# Altium project PT-PWR-EPS-002_v1.PrjPcb (part 1 of 5)
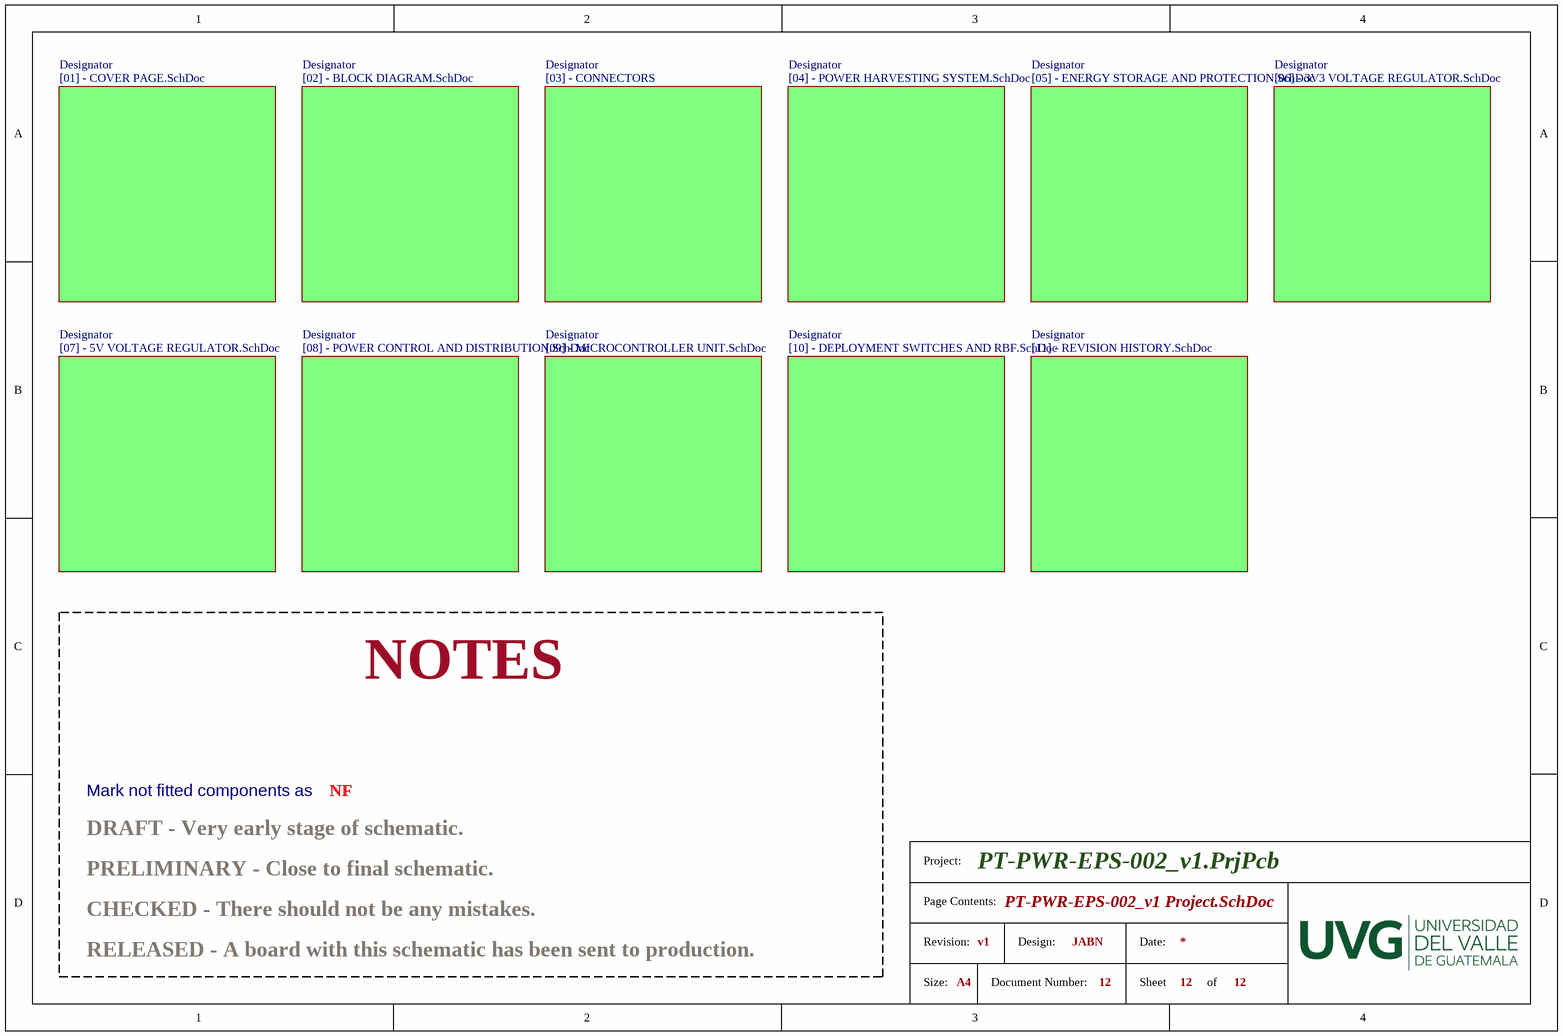
[diagram p0: PT-PWR-EPS-002_v1 Project.SchDoc]
Checked: JABN; DocumentRevision: v1
12 sheets, 217 parts. Net scope: flat (ports and power ports of the same name join across sheets).
Board file: PT-PWR-EPS-002_v1.PcbDoc
Sheets:
  PT-PWR-EPS-002_v1 Project.SchDoc
    Designator = [01] - COVER PAGE.SchDoc
    Designator = [02] - BLOCK DIAGRAM.SchDoc
    Designator = [06] - 3V3 VOLTAGE REGULATOR.SchDoc
    Designator = [04] - POWER HARVESTING SYSTEM.SchDoc
    Designator = [03] - CONNECTORS.SchDoc
    Designator = [05] - ENERGY STORAGE AND PROTECTION.SchDoc
    Designator = [10] - DEPLOYMENT SWITCHES AND RBF.SchDoc
    Designator = [08] - POWER CONTROL AND DISTRIBUTION.SchDoc
    Designator = [07] - 5V VOLTAGE REGULATOR.SchDoc
    Designator = [11] - REVISION HISTORY.SchDoc
    Designator = [09] - MICROCONTROLLER UNIT.SchDoc

## Sheet PT-PWR-EPS-002_v1 Project.SchDoc
size A4; DocumentNumber: 12; SheetNumber: 12; SheetTotal: 12

### Sub-sheets
Designator = [01] - COVER PAGE.SchDoc: no entries
Designator = [02] - BLOCK DIAGRAM.SchDoc: no entries
Designator = [06] - 3V3 VOLTAGE REGULATOR.SchDoc: no entries
Designator = [04] - POWER HARVESTING SYSTEM.SchDoc: no entries
Designator = [03] - CONNECTORS: no entries
Designator = [05] - ENERGY STORAGE AND PROTECTION.SchDoc: no entries
Designator = [10] - DEPLOYMENT SWITCHES AND RBF.SchDoc: no entries
Designator = [08] - POWER CONTROL AND DISTRIBUTION.SchDoc: no entries
Designator = [07] - 5V VOLTAGE REGULATOR.SchDoc: no entries
Designator = [11] - REVISION HISTORY.SchDoc: no entries
Designator = [09] - MICROCONTROLLER UNIT.SchDoc: no entries

### Notes on the sheet
- NOTES
- DRAFT - Very early stage of schematic.
- Mark not fitted components as
- NF
- PRELIMINARY - Close to final schematic.
- CHECKED - There should not be any mistakes.
- RELEASED - A board with this schematic has been sent to production.
- Project:
- Page Contents:
- Size:
- Revision:
- A4
- Document Number:
- Design:
- Date:
- Sheet
- of

## Sheet [01] - COVER PAGE.SchDoc
size A4; DocumentNumber: 1; SheetNumber: 1; SheetTotal: 12
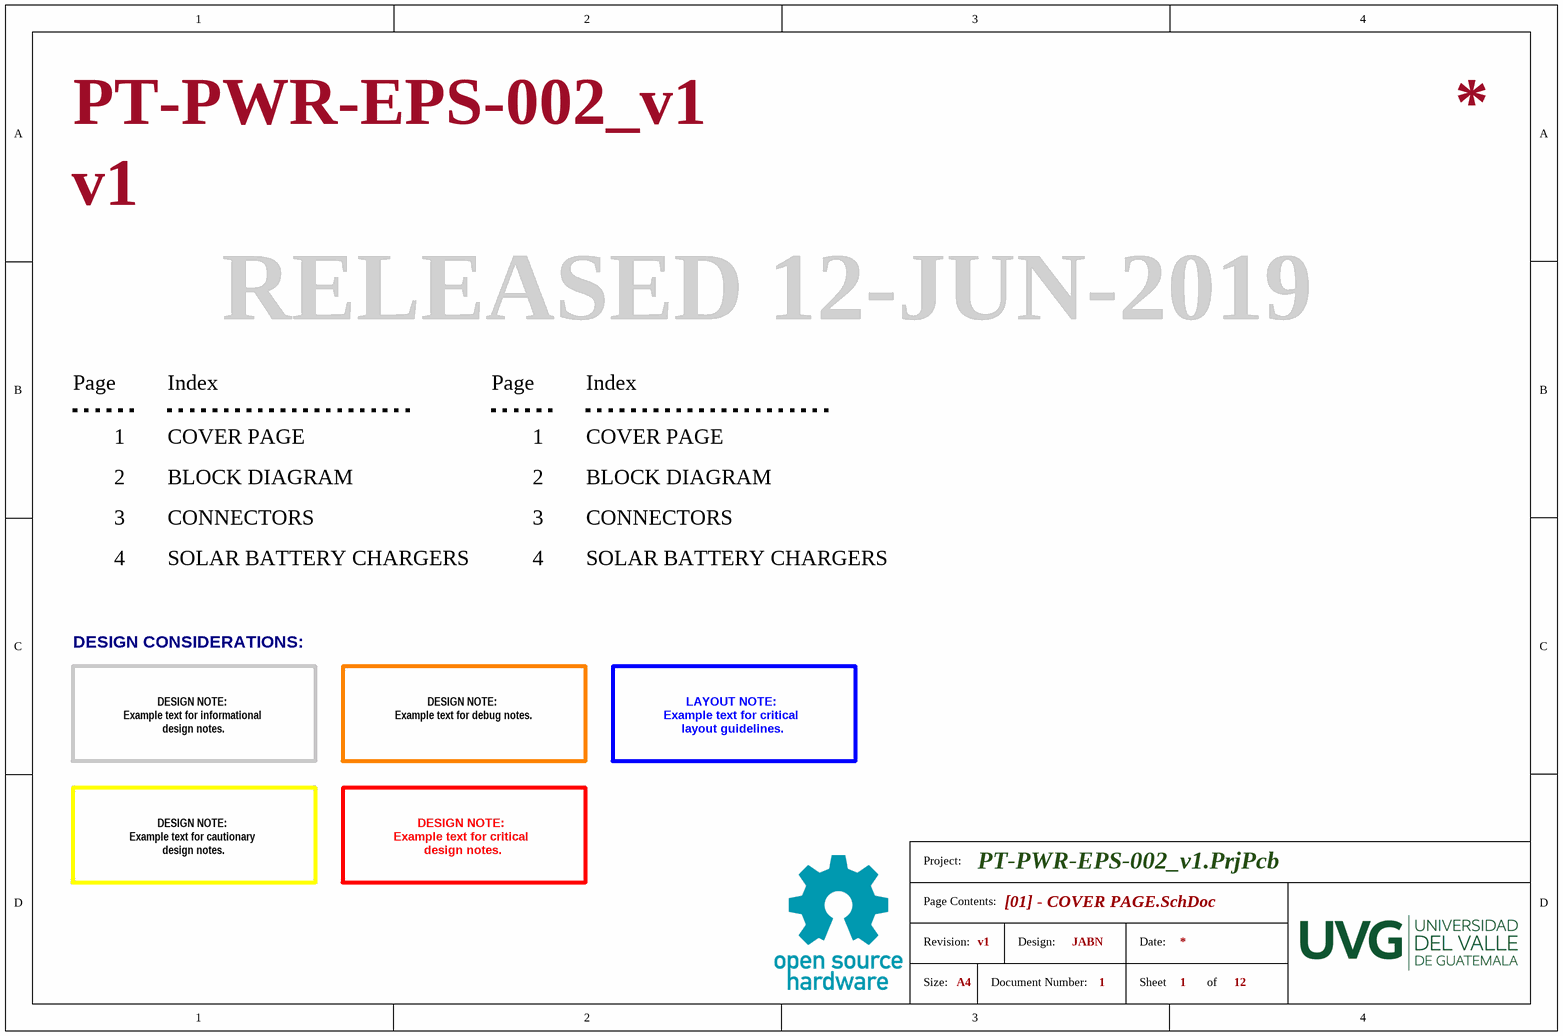
[diagram p1: [01] - COVER PAGE.SchDoc]

### Notes on the sheet
- PT-PWR-EPS-002_v1
- RELEASED 12-JUN-2019
- Page
- 1
- Index
- COVER PAGE
- 2
- BLOCK DIAGRAM
- 3
- 4
- CONNECTORS
- SOLAR BATTERY CHARGERS
- DESIGN CONSIDERATIONS:
- DESIGN NOTE:
  Example text for debug notes.
- DESIGN NOTE:
  Example text for informational
  design notes.
- LAYOUT NOTE:
  Example text for critical
  layout guidelines.
- DESIGN NOTE:
  Example text for cautionary
  design notes.
- DESIGN NOTE:
  Example text for critical
  design notes.
- Project:
- Page Contents:
- Size:
- Revision:
- A4
- Document Number:
- Design:
- Date:
- Sheet
- of

## Sheet [02] - BLOCK DIAGRAM.SchDoc
size A4; DocumentNumber: 2; SheetNumber: 2; SheetTotal: 12
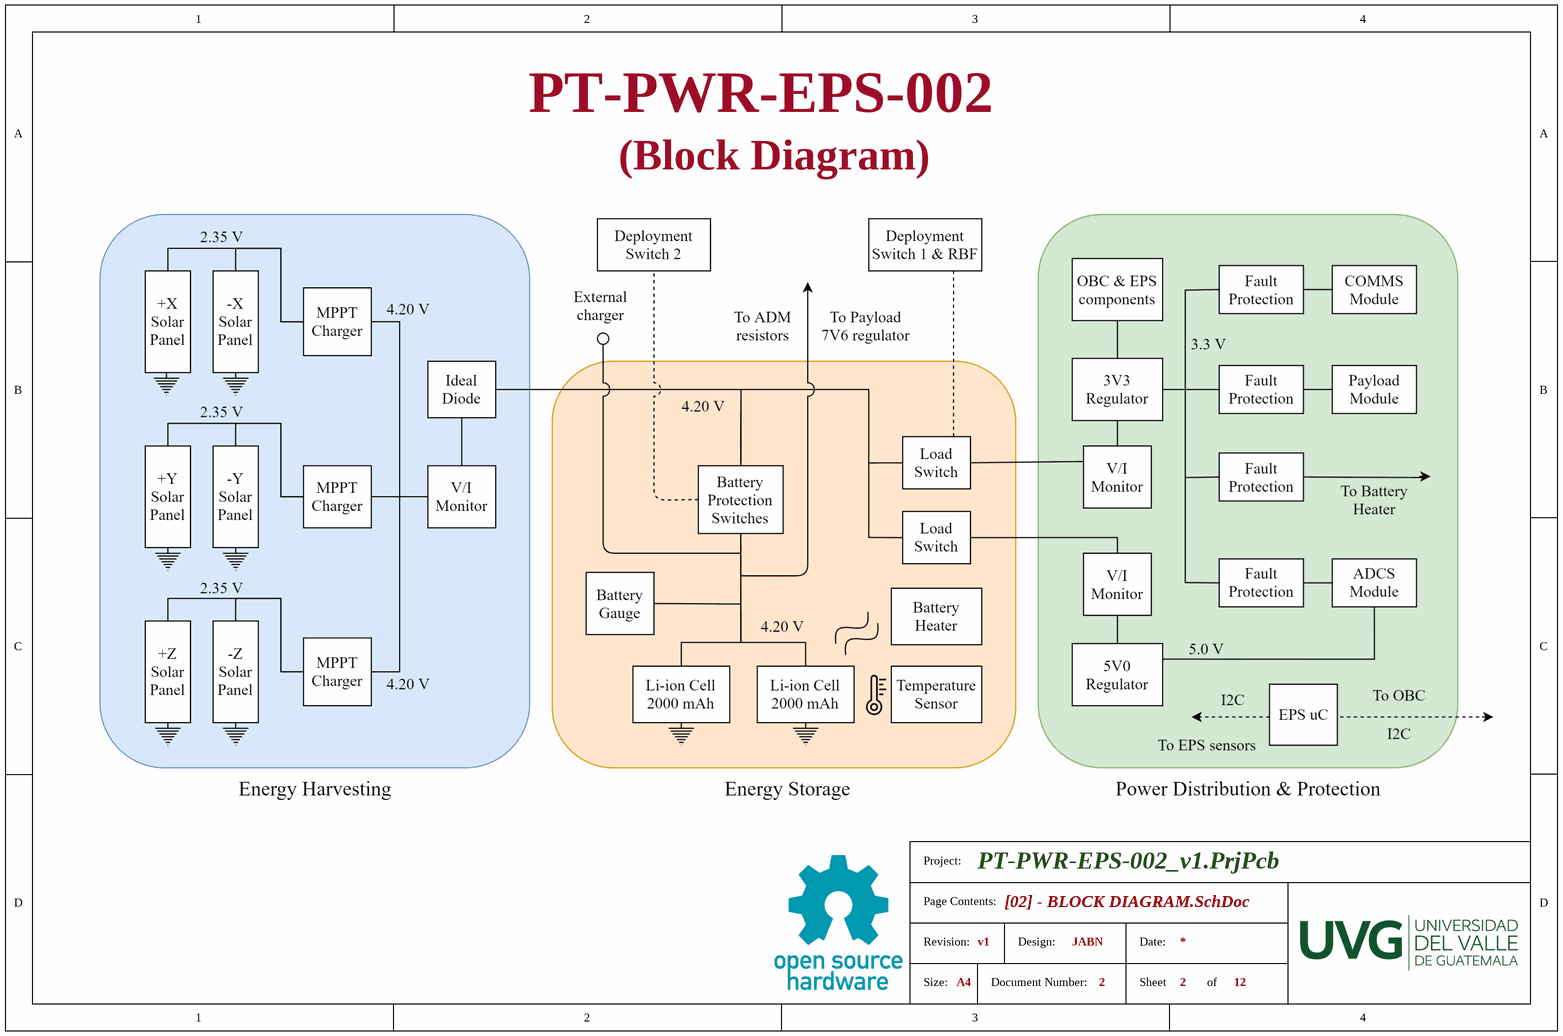
[diagram p2: [02] - BLOCK DIAGRAM.SchDoc]

### Notes on the sheet
- PT-PWR-EPS-002
- (Block Diagram)
- Project:
- Page Contents:
- Size:
- Revision:
- A4
- Document Number:
- Design:
- Date:
- Sheet
- of

## Sheet [06] - 3V3 VOLTAGE REGULATOR.SchDoc
size A2; DocumentNumber: 5; SheetNumber: 5; SheetTotal: 5; PageSetup: Record=PageOptions|CenterHorizontal=True|CenterVertical=True|PrintScale=0.73|XCorrection=1.00|YCorrection=1.00|PrintKind=0|BorderSize=5000000|LeftOffset=0|BottomOffset=0|Orientation=2|PaperLength=1000|PaperWidth=1000|Scale=100|PaperSource=7|PrintQuality=-3|MediaType=1|DitherType=10|PrintScaleMode=1|PaperKind=A3|PaperIndex=8
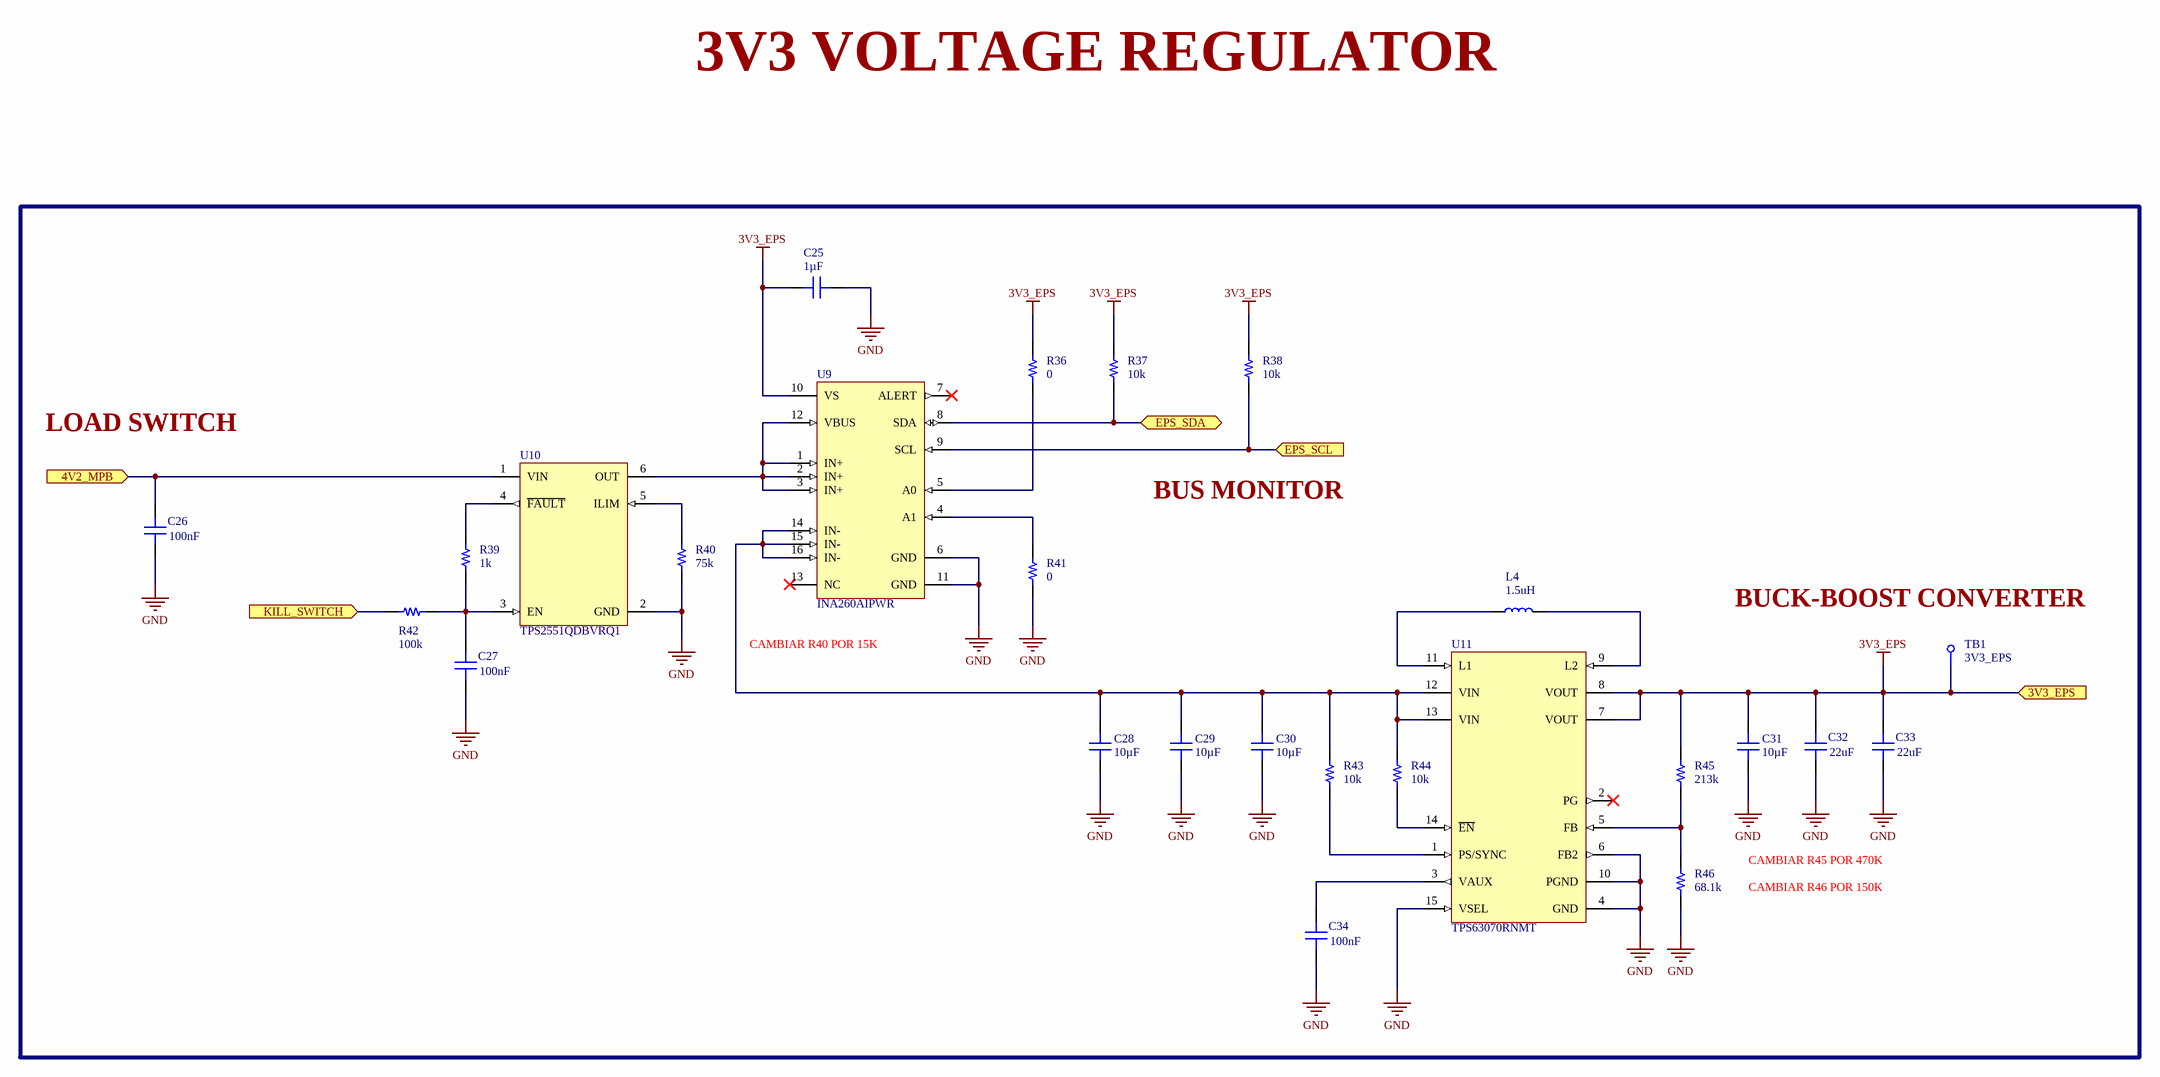
[diagram p3: [06] - 3V3 VOLTAGE REGULATOR.SchDoc]

### Parts
C25  Capacitance: 1µF  [CAP 0603/1608]  (hidden comment: CL10A105KP8NNNC)
C26  Capacitance: 100nF  [CAP 0603/1608]  (hidden comment: C0603C104K8RACTU)
C27  Capacitance: 100nF  [CAP 0603/1608]  (hidden comment: C0603C104K8RACTU)
C28  Capacitance: 10µF  [CAP 0805/2012]  (hidden comment: LMK212BJ106KG-T)
C29  Capacitance: 10µF  [CAP 0805/2012]  (hidden comment: LMK212BJ106KG-T)
C30  Capacitance: 10µF  [CAP 0603/1608]  (hidden comment: CL10A106MQ8NNNC)
C31  Capacitance: 10µF  [CAP 0603/1608]  (hidden comment: CL10A106MQ8NNNC)
C32  Capacitance: 22uF  [CAP 0805/2012]  (hidden comment: CL21A226MQQNNNE)
C33  Capacitance: 22uF  [CAP 0805/2012]  (hidden comment: CL21A226MQQNNNE)
C34  Capacitance: 100nF  [CAP 0603/1608]  (hidden comment: C0603C104K8RACTU)
L4  Inductance: 1.5uH  [XFL4020]  (hidden comment: XFL4020-152MEB)
R36  Resistance: 0  [RES 0603/1608]  (hidden comment: RMCF0603ZT0R00)
R37  Resistance: 10k  [RES 0603/1608]  (hidden comment: RNCP0603FTD10K0)
R38  Resistance: 10k  [RES 0603/1608]  (hidden comment: RNCP0603FTD10K0)
R39  Resistance: 1k  [RES 0603/1608]  (hidden comment: ESR03EZPJ102)
R40  Resistance: 75k  [RES 0603/1608]  (hidden comment: ERJ3EKF7502V)
R41  Resistance: 0  [RES 0603/1608]  (hidden comment: RMCF0603ZT0R00)
R42  Resistance: 100k  [RES 0603/1608]  (hidden comment: CR0603-JW-104ELF)
R43  Resistance: 10k  [RES 0805/2012]  (hidden comment: RC0805FR-0710KL)
R44  Resistance: 10k  [RES 0805/2012]  (hidden comment: RC0805FR-0710KL)
R45  Resistance: 213k  [RES 0603/1608]  (hidden comment: RNCF0603BTE213K)
R46  Resistance: 68.1k  [RES 0603/1608]  (hidden comment: RMCF0603FT68K1)
TB1  3V3_EPS  [Testpoint]
U9  INA260AIPWR  [TSOP65P640X120-16N]
U10  TPS2551QDBVRQ1  [SOT23-6]
U11  TPS63070RNMT  [15-VQFN-HR]

### Ports
3V3_EPS (in), 4V2_MPB (in), EPS_SCL (in), EPS_SDA (bidir), KILL_SWITCH (in)

### Nets
3V3_EPS: C25.1 C31.2 C32.2 C33.2 R36.2 R37.2 R38.2 R45.2 TB1.1 U9.10(VS) U11.7(VOUT) U11.8(VOUT) ; port 3V3_EPS
4V2_MPB: C26.2 U10.1(VIN) ; port 4V2_MPB
GND: C25.2 C26.1 C27.1 C28.1 C29.1 C30.1 C31.1 C32.1 C33.1 C34.1 R40.1 R41.1 R46.1 U9.6(GND) U9.11(GND) U10.2(GND) U11.4(GND) U11.6(FB2) U11.10(PGND) U11.15(VSEL)
NetC27_2: C27.2 R39.1 R42.2 U10.3(EN)
NetC28_2: C28.2 C29.2 C30.2 R43.2 R44.2 U9.14(IN-) U9.15(IN-) U9.16(IN-) U11.12(VIN) U11.13(VIN)
NetC34_2: C34.2 U11.3(VAUX)
NetL4_1: L4.1 U11.11(L1)
NetL4_2: L4.2 U11.9(L2)
NetP11_2: R37.1 U9.8(SDA) ; port EPS_SDA
NetP11_3: R38.1 U9.9(SCL) ; port EPS_SCL
NetR36_1: R36.1 U9.5(A0)
NetR39_2: R39.2 U10.4(~{FAULT})
NetR40_2: R40.2 U10.5(ILIM)
NetR41_2: R41.2 U9.4(A1)
NetR42_1: R42.1 ; port KILL_SWITCH
NetR43_1: R43.1 U11.1(PS/SYNC)
NetR44_1: R44.1 U11.14(~{EN})
NetR45_1: R45.1 R46.2 U11.5(FB)
NetU9_1: U9.1(IN+) U9.2(IN+) U9.3(IN+) U9.12(VBUS) U10.6(OUT)

Not connected (* = marked no-connect by the designer): U9 7(ALERT)* 13(NC)*; U11 2(PG)*

### Notes on the sheet
- 3V3 VOLTAGE REGULATOR
- LOAD SWITCH
- BUS MONITOR
- (near TB1) BUCK-BOOST CONVERTER
- CAMBIAR R40 POR 15K
- CAMBIAR R45 POR 470K
- CAMBIAR R46 POR 150K
- Project:
- Page Contents:
- Size:
- Revision:
- A2
- Document Number:
- Design:
- Date:
- Sheet
- of

### Library data of the parts
C25 = CL10A105KP8NNNC: CAP CER 1UF 10V X5R 0603; Manufacturer: Samsung; Tolerance: 10%; Supplier 1: Digi-Key; Manufacturer Part Number: CL10A105KP8NNNC; Stock 1: 4411775; Pricing 1: 1 = 0.10000, 10 = 0.03800, 100 = 0.01680, 500 = 0.01200, 1000 = 0.00943 (USD); RoHS: Yes; Mount: Surface Mount; Case/Package: 0603; Case Code (Metric): 1608; Case Code (Imperial): 0603; Contact Plating: Tin; Min Operating Temperature: -55°C; Max Operating Temperature: 85°C; Packaging: Tape and Reel; Package Quantity: 1; Voltage Rating: 10V; Dielectric: X5R; Voltage: 10V; Length: 1.6mm; Height: 0.8mm; Width: 0.031inch; Thickness: 0.035inch; Depth: 0.8mm; Radiation Hardening: No; ComponentLink1URL: https://datasheet.ciiva.com/15195/getdatasheetpartid-358616-15195708.pdf?src-supplier=Verical; ComponentLink1Description: https://datasheet.ciiva.com/15195/getdatasheetpartid-358616-15195708.pdf?src-supplier=Verical; ComponentLink2URL: https://datasheet.ciiva.com/16358/cl05b104kq5nnnc-16358431.pdf?src-supplier=Future+Electronics; ComponentLink2Description: https://datasheet.ciiva.com/16358/cl05b104kq5nnnc-16358431.pdf?src-supplier=Future+Electronics; Supplier Part Number 1: 1276-1182-1-ND
C26 C27 C34 = C0603C104K8RACTU: CAP CER 0.1UF 10V X7R 0603; Manufacturer: KEMET; Dielectric Material: Ceramic; Tolerance: 10%; Dissipation Factor: 5%; Supplier 1: Digi-Key; Manufacturer Part Number: C0603C104K8RACTU; Stock 1: 778651; Pricing 1: 1=0.15, 10=0.107, 100=0.0504, 500=0.03536, 1000=0.02927 (USD); Mount: Surface Mount,PCB; Case/Package: 0603; Number of Pins: 2; Case Code (Imperial): 0603; Case Code (Metric): 1608; Contact Plating: Tin,Matte; Min Operating Temperature: -55°C; Max Operating Temperature: 125°C; Voltage Rating: 10V; Packaging: Tape and Reel; Package Quantity: 1; Voltage Rating (DC): 10V; Dielectric: X7R; Termination: SMD/SMT; Voltage: 10V; Length: 1.6mm; Height: 0.8mm; Width: 0.8mm; Lead Pitch: 0.7mm; Thickness: 0.034inch; Depth: 0.8mm; Radiation Hardening: No; REACH SVHC: No SVHC; ComponentLink1URL: http://www.farnell.com/datasheets/2315110.pdf?src-supplier=Farnell; ComponentLink1Description: http://www.farnell.com/datasheets/2315110.pdf?src-supplier=Farnell; ComponentLink2URL: http://www.kemet.com/kemet/web/homepage/kechome.nsf/vapubfiles/KEM_C1002_X7R_SMD.pdf/$file/KEM_C1002_X7R_SMD.pdf?src-supplier=Element14; ComponentLink2Description: http://www.kemet.com/kemet/web/homepage/kechome.nsf/vapubfiles/KEM_C1002_X7R_SMD.pdf/$file/KEM_C1002_X7R_SMD.pdf?src-supplier=Element14; ComponentLink3URL: https://www.verical.com/server-webapp/html/getDatasheet?partID=91529&src-supplier=Verical; ComponentLink3Description: https://www.verical.com/server-webapp/html/getDatasheet?partID=91529&src-supplier=Verical; ComponentLink4URL: http://www.mouser.com/ds/2/212/KEM_C1002_X7R_SMD-1102033.pdf?src-supplier=Mouser; ComponentLink4Description: http://www.mouser.com/ds/2/212/KEM_C1002_X7R_SMD-1102033.pdf?src-supplier=Mouser; ComponentLink5URL: http://www.alliedelec.com/m/d/9bfe7773041ffe9d406e68bc7b377fdd.pdf?src-supplier=Allied+Electronics; ComponentLink5Description: http://www.alliedelec.com/m/d/9bfe7773041ffe9d406e68bc7b377fdd.pdf?src-supplier=Allied+Electronics; ComponentLink6URL: http://www.farnell.com/datasheets/1851736.pdf?src-supplier=Element14; ComponentLink6Description: http://www.farnell.com/datasheets/1851736.pdf?src-supplier=Element14; Supplier Part Number 1: 399-1095-1-ND
C28 C29 = LMK212BJ106KG-T: CAP CER 10UF 10V X5R 0805; Manufacturer: Taiyo Yuden; PCN Part Number: X5R, X7R Dielectrics 23/Jan/2008; Catalog Drawings: xMK Series_0805_1.25; Featured Product: Multilayer Chip Capacitors; Tolerance: ±10%; Online Catalog: M Series; Kits: 587-1797-KIT-ND  - KIT CAP CER HI CAP 0603 & 0805 S; Other Names: 587-1300-1; Supplier 1: Digi-Key; Manufacturer Part Number: LMK212BJ106KG-T; Stock 1: 858762; Pricing 1: 1=0.14, 10=0.1, 100=0.0468, 500=0.0328, 1000=0.0272 (USD); Standard Package: 1; Category: Capacitors; Family: Ceramic Capacitors; Series: M; Packaging: Cut Tape (CT); Voltage - Rated: 10V; Temperature Coefficient: X5R; Mounting Type: Surface Mount, MLCC; Operating Temperature: -55°C ~ 85°C; Applications: General Purpose; Ratings: -; Package / Case: 0805 (2012 Metric); Size / Dimension: 0.079" L x 0.049" W (2.00mm x 1.25mm); Height - Seated (Max): -; Thickness (Max): 0.053" (1.35mm); Lead Spacing: -; Features: -; Lead Style: -; ComponentLink1URL: https://datasheet.ciiva.com/26872/getdatasheetpartid-638410-26872692.pdf; ComponentLink1Description: https://datasheet.ciiva.com/26872/getdatasheetpartid-638410-26872692.pdf; ComponentLink2URL: https://datasheet.ciiva.com/7975/1497285-7975797.pdf; ComponentLink2Description: https://datasheet.ciiva.com/7975/1497285-7975797.pdf; ComponentLink3URL: https://datasheet.ciiva.com/7975/1497285-7975799.pdf; ComponentLink3Description: https://datasheet.ciiva.com/7975/1497285-7975799.pdf; ComponentLink4URL: https://datasheet.ciiva.com/135/mlcc-all-e-135133.pdf; ComponentLink4Description: https://datasheet.ciiva.com/135/mlcc-all-e-135133.pdf; ComponentLink5URL: https://datasheet.ciiva.com/135/mlcc-all-e-135134.pdf; ComponentLink5Description: https://datasheet.ciiva.com/135/mlcc-all-e-135134.pdf; ComponentLink6URL: https://datasheet.ciiva.com/30259/719lmk212abj106kg-t-30259022.pdf; ComponentLink6Description: https://datasheet.ciiva.com/30259/719lmk212abj106kg-t-30259022.pdf; ComponentLink7URL: https://datasheet.ciiva.com/135/mlcc-all-e-135135.pdf; ComponentLink7Description: https://datasheet.ciiva.com/135/mlcc-all-e-135135.pdf; Supplier Part Number 1: 587-1300-1-ND
C30 C31 = CL10A106MQ8NNNC: CAP CER 10UF 6.3V X5R 0603; Manufacturer: Samsung; Tolerance: 20%; Supplier 1: Digi-Key; Manufacturer Part Number: CL10A106MQ8NNNC; Stock 1: 3866590; Pricing 1: 1 = 0.15000, 10 = 0.11000, 100 = 0.05150, 500 = 0.03614, 1000 = 0.02992 (USD); RoHS: Yes; Mount: Surface Mount; Case/Package: 0603; Case Code (Metric): 1608; Case Code (Imperial): 0603; Contact Plating: Tin; Min Operating Temperature: -55°C; Max Operating Temperature: 85°C; Package Quantity: 1; Packaging: Tape and Reel; Voltage Rating: 6.3V; Dielectric: X5R; Voltage: 6.3V; Length: 1.6mm; Height: 0.8mm; Width: 0.031inch; Thickness: 0.035inch; Depth: 0.8mm; Radiation Hardening: No; ComponentLink1URL: https://datasheet.ciiva.com/25798/cl10a106mq8nnnc-25798320.pdf?src-supplier=Digi-Key; ComponentLink1Description: https://datasheet.ciiva.com/25798/cl10a106mq8nnnc-25798320.pdf?src-supplier=Digi-Key; ComponentLink2URL: https://datasheet.ciiva.com/26838/getdatasheetpartid-357557-26838347.pdf?src-supplier=Verical; ComponentLink2Description: https://datasheet.ciiva.com/26838/getdatasheetpartid-357557-26838347.pdf?src-supplier=Verical; ComponentLink3URL: https://datasheet.ciiva.com/16437/cl05b104kq5nnnc-16437327.pdf?src-supplier=Future+Electronics; ComponentLink3Description: https://datasheet.ciiva.com/16437/cl05b104kq5nnnc-16437327.pdf?src-supplier=Future+Electronics; Supplier Part Number 1: 1276-1119-1-ND
C32 C33 = CL21A226MQQNNNE: CAP CER 22UF 6.3V X5R 0805; Manufacturer: Samsung; Tolerance: 20%; Supplier 1: Digi-Key; Manufacturer Part Number: CL21A226MQQNNNE; Stock 1: 20000; Pricing 1: 1=0.22, 10=0.152, 100=0.0768, 500=0.05256, 1000=0.04649 (USD); Mount: Surface Mount; Case/Package: 0805; Contact Plating: Tin; Case Code (Metric): 2012; Case Code (Imperial): 0805; Min Operating Temperature: -55°C; Max Operating Temperature: 85°C; Package Quantity: 2000; Packaging: Tape and Reel; Voltage Rating: 6.3V; Dielectric: X5R; Voltage Rating (DC): 6.3V; Length: 2mm; Height: 1.25mm; Width: 0.049inch; Thickness: 0.055inch; Depth: 1.25mm; Radiation Hardening: No; Lead Free: Lead Free; ComponentLink1URL: https://datasheet.ciiva.com/25796/cl21a226mqqnnne-25796195.pdf; ComponentLink1Description: https://datasheet.ciiva.com/25796/cl21a226mqqnnne-25796195.pdf; ComponentLink2URL: https://datasheet.ciiva.com/26838/getdatasheetpartid-357607-26838611.pdf; ComponentLink2Description: https://datasheet.ciiva.com/26838/getdatasheetpartid-357607-26838611.pdf; ComponentLink3URL: https://datasheet.ciiva.com/16361/cl21a226mqqnnne-16361189.pdf; ComponentLink3Description: https://datasheet.ciiva.com/16361/cl21a226mqqnnne-16361189.pdf; ComponentLink4URL: https://datasheet.ciiva.com/26787/cl21a226mqqnnne-26787006.pdf; ComponentLink4Description: https://datasheet.ciiva.com/26787/cl21a226mqqnnne-26787006.pdf; Supplier Part Number 1: 1276-1100-6-ND
L4 = XFL4020-152MEB: FIXED IND 1.5UH 9.1A 15.8 MOHM SMD; Manufacturer: Coilcraft; Core Material: Composite; Self Resonant Frequency: 59MHz; Shielding: Shielded; Tolerance: 20%; DC Resistance (DCR): 15.8mR; Test Frequency: 100kHz; Supplier 1: Mouser; Manufacturer Part Number: XFL4020-152MEB; Stock 1: 11555; Pricing 1: 1 = 1.99000, 10 = 1.99000, 50 = 1.99000, 100 = 1.59000, 1000 = 0.88500, 10000 = 0.88500 (USD); RoHS: Yes; Min Operating Temperature: -40°C; Max Operating Temperature: 125°C; Packaging: Tape and Reel; Max DC Current: 9.1A; Termination: SMD/SMT; Package Quantity: 25; Length: 4.3mm; Height: 2.1mm; Width: 4.3mm; Lead Free: Contains Lead; ComponentLink1URL: http://www.mouser.com/ds/2/597/xfl4020-270756.pdf?src-supplier=Mouser; ComponentLink1Description: http://www.mouser.com/ds/2/597/xfl4020-270756.pdf?src-supplier=Mouser; Supplier Part Number 1: 994-XFL4020-152MEB
R36 R41 = RMCF0603ZT0R00: RES SMD 0 OHM JUMPER 1/10W 0603; Manufacturer: Stackpole Electronics; Power Rating: 100mW; Current Rating: 1A; Working Voltage: 75V; Supplier 1: Digi-Key; Manufacturer Part Number: RMCF0603ZT0R00; Stock 1: 3031399; Pricing 1: 1 = 0.10000, 10 = 0.01600, 25 = 0.01160, 50 = 0.00880, 100 = 0.00640, 250 = 0.00492, 500 = 0.00392, 1000 = 0.00289 (USD); RoHS: Yes; Mount: Surface Mount; Case/Package: 0603; Case Code (Metric): 1608; Case Code (Imperial): 0603; Contact Plating: Tin; Min Operating Temperature: -55°C; Max Operating Temperature: 155°C; Packaging: Tape and Reel; Composition: Thick Film; Number of Terminations: 2; Military Standard: Not; Max Power Dissipation: 100mW; Features: Automotive AEC-Q200; Length: 1.55mm; Height: 0.022inch; Width: 0.031inch; Depth: 0.8mm; Radiation Hardening: No; Lead Free: Lead Free; ComponentLink1URL: https://www.seielect.com/catalog/SEI-Packaging.pdf?src-supplier=Avnet; ComponentLink1Description: https://www.seielect.com/catalog/SEI-Packaging.pdf?src-supplier=Avnet; ComponentLink2URL: https://www.seielect.com/catalog/SEI-Packaging.pdf?src-supplier=Verical; ComponentLink2Description: https://www.seielect.com/catalog/SEI-Packaging.pdf?src-supplier=Verical; ComponentLink3URL: https://www.seielect.com/catalog/SEI-Packaging.pdf?src-supplier=Arrow; ComponentLink3Description: https://www.seielect.com/catalog/SEI-Packaging.pdf?src-supplier=Arrow; ComponentLink4URL: https://www.seielect.com/catalog/SEI-Packaging.pdf?src-supplier=Digi-Key; ComponentLink4Description: https://www.seielect.com/catalog/SEI-Packaging.pdf?src-supplier=Digi-Key; ComponentLink5URL: https://www.seielect.com/Catalog/SEI-RMCF_RMCP.pdf?src-supplier=Digi-Key; ComponentLink5Description: https://www.seielect.com/Catalog/SEI-RMCF_RMCP.pdf?src-supplier=Digi-Key; ComponentLink6URL: https://www.seielect.com/catalog/SEI-Packaging.pdf?src-supplier=Future+Electronics; ComponentLink6Description: https://www.seielect.com/catalog/SEI-Packaging.pdf?src-supplier=Future+Electronics; Supplier Part Number 1: RMCF0603ZT0R00CT-ND
R37 R38 = RNCP0603FTD10K0: RES SMD 10K OHM 1% 1/8W 0603; Manufacturer: Stackpole Electronics; Max Power Dissipation: 125mW; Temperature Coefficient: 100ppm/°C; Supplier 1: Digi-Key; Manufacturer Part Number: RNCP0603FTD10K0; Stock 1: 579582; Pricing 1: 1 = 0.10000, 10 = 0.06700, 100 = 0.02730, 1000 = 0.01224, 2500 = 0.01063 (USD); RoHS: Yes; Mount: Surface Mount; Case/Package: 0603; Case Code (Metric): 1608; Case Code (Imperial): 0603; Contact Plating: Tin; Min Operating Temperature: -55°C; Max Operating Temperature: 155°C; Packaging: Tape and Reel; Tolerance: 1%; Composition: Thin Film; Number of Terminations: 2; Features: Moisture Resistant; Length: 0.059inch; Height: 0.02inch; Width: 0.031inch; Radiation Hardening: No; Lead Free: Lead Free; ComponentLink1URL: https://www.seielect.com/Catalog/SEI-rncp.pdf?src-supplier=Avnet; ComponentLink1Description: https://www.seielect.com/Catalog/SEI-rncp.pdf?src-supplier=Avnet; ComponentLink2URL: https://www.seielect.com/catalog/SEI-Packaging.pdf?src-supplier=Digi-Key; ComponentLink2Description: https://www.seielect.com/catalog/SEI-Packaging.pdf?src-supplier=Digi-Key; ComponentLink3URL: https://www.seielect.com/Catalog/SEI-rncp.pdf?src-supplier=Digi-Key; ComponentLink3Description: https://www.seielect.com/Catalog/SEI-rncp.pdf?src-supplier=Digi-Key; Supplier Part Number 1: RNCP0603FTD10K0CT-ND
R39 = ESR03EZPJ102: RES SMD 1K OHM 5% 1/4W 0603; Manufacturer: Rohm; Temperature Coefficient: 200ppm/°C; Max Power Dissipation: 250mW; Supplier 1: Digi-Key; Manufacturer Part Number: ESR03EZPJ102; Stock 1: 187581; Pricing 1: 1 = 0.10000, 10 = 0.08300, 100 = 0.03180, 1000 = 0.01398, 2500 = 0.01207 (USD); RoHS: Yes; Case/Package: 0603; Case Code (Metric): 1608; Case Code (Imperial): 0603; Min Operating Temperature: -55°C; Max Operating Temperature: 155°C; Tolerance: 5%; Package Quantity: 1; Packaging: Tape and Reel; Composition: Thick Film; Number of Terminations: 2; Features: Automotive AEC-Q200; Length: 0.063inch; Height: 0.022inch; Width: 0.031inch; Lead Free: Lead Free; ComponentLink1URL: https://datasheet.ciiva.com/2469/esr-2469603.pdf?src-supplier=Digi-Key; ComponentLink1Description: https://datasheet.ciiva.com/2469/esr-2469603.pdf?src-supplier=Digi-Key; ComponentLink2URL: https://datasheet.ciiva.com/2469/esr-2469604.pdf?src-supplier=Digi-Key; ComponentLink2Description: https://datasheet.ciiva.com/2469/esr-2469604.pdf?src-supplier=Digi-Key; ComponentLink3URL: https://datasheet.ciiva.com/2469/esr-2469605.pdf?src-supplier=Digi-Key; ComponentLink3Description: https://datasheet.ciiva.com/2469/esr-2469605.pdf?src-supplier=Digi-Key; Supplier Part Number 1: RHM1.0KDCT-ND
R40 = ERJ3EKF7502V: RES SMD 75K OHM 1% 1/10W 0603; Manufacturer: Panasonic; Power Rating: 100mW; Voltage Rating: 75V; Temperature Coefficient: 100ppm/°C; Voltage Rating (DC): 50V; Supplier 1: Digi-Key; Manufacturer Part Number: ERJ3EKF7502V; Stock 1: 1035475; Pricing 1: 1 = 0.10000, 10 = 0.06500, 100 = 0.02640, 1000 = 0.01186, 2500 = 0.01029 (USD); RoHS: Yes; Mount: Surface Mount; Case/Package: 0603; Case Code (Metric): 1608; Case Code (Imperial): 0603; Contact Plating: Tin; Min Operating Temperature: -55°C; Max Operating Temperature: 155°C; Tolerance: 1%; Packaging: Tape and Reel; Package Quantity: 1; Composition: Thick Film; Number of Terminations: 2; Termination: SMD/SMT; Military Standard: Not; Max Power Dissipation: 100mW; Features: Automotive AEC-Q200; Length: 1.6mm; Height: 0.45mm; Width: 0.031inch; Depth: 0.8mm; Radiation Hardening: No; REACH SVHC: No SVHC; Lead Free: Lead Free; ComponentLink1URL: https://datasheet.ciiva.com/34303/1988401-34303605.pdf?src-supplier=Jameco; ComponentLink1Description: https://datasheet.ciiva.com/34303/1988401-34303605.pdf?src-supplier=Jameco; ComponentLink2URL: https://datasheet.ciiva.com/24069/aoa0000ce2-24069064.pdf?src-supplier=Mouser; ComponentLink2Description: https://datasheet.ciiva.com/24069/aoa0000ce2-24069064.pdf?src-supplier=Mouser; ComponentLink3URL: https://datasheet.ciiva.com/28596/1678782-28596232.pdf?src-supplier=Element14; ComponentLink3Description: https://datasheet.ciiva.com/28596/1678782-28596232.pdf?src-supplier=Element14; ComponentLink4URL: https://datasheet.ciiva.com/15159/getdatasheetpartid-28812-15159210.pdf?src-supplier=Verical; ComponentLink4Description: https://datasheet.ciiva.com/15159/getdatasheetpartid-28812-15159210.pdf?src-supplier=Verical; ComponentLink5URL: https://datasheet.ciiva.com/31835/aoa0000ce2-31835674.pdf?src-supplier=Onlinecomponents.com; ComponentLink5Description: https://datasheet.ciiva.com/31835/aoa0000ce2-31835674.pdf?src-supplier=Onlinecomponents.com; ComponentLink6URL: https://datasheet.ciiva.com/28676/1678782-28676971.pdf?src-supplier=Element14; ComponentLink6Description: https://datasheet.ciiva.com/28676/1678782-28676971.pdf?src-supplier=Element14; ComponentLink7URL: https://datasheet.ciiva.com/46374/426256-46374235.pdf?src-supplier=Element14; ComponentLink7Description: https://datasheet.ciiva.com/46374/426256-46374235.pdf?src-supplier=Element14; ComponentLink8URL: https://datasheet.ciiva.com/48531/aoa0000ce2-48531550.pdf?src-supplier=Avnet; ComponentLink8Description: https://datasheet.ciiva.com/48531/aoa0000ce2-48531550.pdf?src-supplier=Avnet; ComponentLink9URL: https://datasheet.ciiva.com/9187/aoa0000ce2-9187719.pdf?src-supplier=Avnet; ComponentLink9Description: https://datasheet.ciiva.com/9187/aoa0000ce2-9187719.pdf?src-supplier=Avnet; Supplier Part Number 1: P75.0KHCT-ND
R42 = CR0603-JW-104ELF: RES SMD 100K OHM 5% 1/10W 0603; Manufacturer: Bourns; Power Rating: 100mW; Voltage Rating: 50V; Temperature Coefficient: 200ppm/°C; Supplier 1: Digi-Key; Manufacturer Part Number: CR0603-JW-104ELF; Stock 1: 138181; Pricing 1: 1 = 0.10000, 10 = 0.01500, 25 = 0.01080, 50 = 0.00840, 100 = 0.00610, 250 = 0.00468, 500 = 0.00374, 1000 = 0.00275 (USD); RoHS: Yes; Mount: Surface Mount; Case/Package: 0603; Number of Pins: 2; Case Code (Imperial): 0603; Case Code (Metric): 1608; Contact Plating: Tin; Min Operating Temperature: -55°C; Max Operating Temperature: 155°C; Packaging: Tape and Reel; Tolerance: 5%; Package Quantity: 5000; Composition: Thick Film; Termination: SMD/SMT; Working Voltage: 50V; Military Standard: Not; Voltage Rating (DC): 50V; Length: 1.6mm; Height: 0.45mm; Width: 0.8mm; Depth: 0.8mm; Thickness: 457um; Radiation Hardening: No; REACH SVHC: No SVHC; ComponentLink1URL: https://datasheet.ciiva.com/22713/691949-22713239.pdf?src-supplier=Element14; ComponentLink1Description: https://datasheet.ciiva.com/22713/691949-22713239.pdf?src-supplier=Element14; ComponentLink2URL: https://datasheet.ciiva.com/23776/1902866-23776391.pdf?src-supplier=Newark; ComponentLink2Description: https://datasheet.ciiva.com/23776/1902866-23776391.pdf?src-supplier=Newark; ComponentLink3URL: https://datasheet.ciiva.com/16766/70154685-16766760.pdf?src-supplier=Allied+Electronics; ComponentLink3Description: https://datasheet.ciiva.com/16766/70154685-16766760.pdf?src-supplier=Allied+Electronics; ComponentLink4URL: https://datasheet.ciiva.com/30229/159chpreztr-30229129.pdf?src-supplier=Onlinecomponents.com; ComponentLink4Description: https://datasheet.ciiva.com/30229/159chpreztr-30229129.pdf?src-supplier=Onlinecomponents.com; ComponentLink5URL: https://datasheet.ciiva.com/16935/chpreztr-16935963.pdf?src-supplier=Avnet+Europe; ComponentLink5Description: https://datasheet.ciiva.com/16935/chpreztr-16935963.pdf?src-supplier=Avnet+Europe; ComponentLink6URL: https://datasheet.ciiva.com/5543/chpreztr-5543676.pdf?src-supplier=Mouser; ComponentLink6Description: https://datasheet.ciiva.com/5543/chpreztr-5543676.pdf?src-supplier=Mouser; ComponentLink7URL: https://datasheet.ciiva.com/9120/chpreztr-9120764.pdf?src-supplier=Avnet; ComponentLink7Description: https://datasheet.ciiva.com/9120/chpreztr-9120764.pdf?src-supplier=Avnet; ComponentLink8URL: https://datasheet.ciiva.com/46383/1791942-46383790.pdf?src-supplier=Element14; ComponentLink8Description: https://datasheet.ciiva.com/46383/1791942-46383790.pdf?src-supplier=Element14; ComponentLink9URL: https://datasheet.ciiva.com/48692/001055501-da-01-en-smd-wid-cr0603-jw-104elf-100k-ohm-1-10w-48692133.pdf?src-supplier=Conrad; ComponentLink9Description: https://datasheet.ciiva.com/48692/001055501-da-01-en-smd-wid-cr0603-jw-104elf-100k-ohm-1-10w-48692133.pdf?src-supplier=Conrad; Supplier Part Number 1: CR0603-JW-104ELFCT-ND
R43 R44 = RC0805FR-0710KL: RES SMD 10K OHM 1% 1/8W 0805; Manufacturer: Yageo; Power Rating: 125 mW (1/8 W); Voltage Rating: 150 V; Temperature Coefficient: 100 PPM / C; Supplier 1: Digi-Key; Manufacturer Part Number: RC0805FR-0710KL; Stock 1: 19355771; Pricing 1: 1=0.1, 10=0.022, 100=0.0088, 1000=0.004, 2500=0.0034 (USD); Termination Style: SMD/SMT; Product: Thick Film Resistors General Purpose; Tolerance: 1 %; Case Code - in: 0805; Case Code - mm: 2012; Series: RC; Operating Temperature Range: - 55 C to + 155 C; Packaging: Reel; ComponentLink1URL: https://datasheet.ciiva.com/11808/0900766b8106beab-11808151.pdf; ComponentLink1Description: https://datasheet.ciiva.com/11808/0900766b8106beab-11808151.pdf; ComponentLink2URL: https://datasheet.ciiva.com/12669/rc0805-12669688.pdf; ComponentLink2Description: https://datasheet.ciiva.com/12669/rc0805-12669688.pdf; ComponentLink3URL: https://datasheet.ciiva.com/46447/444164-46447563.pdf; ComponentLink3Description: https://datasheet.ciiva.com/46447/444164-46447563.pdf; ComponentLink4URL: https://datasheet.ciiva.com/2456/pyu-r-int-thick-7-2456972.pdf; ComponentLink4Description: https://datasheet.ciiva.com/2456/pyu-r-int-thick-7-2456972.pdf; ComponentLink5URL: https://datasheet.ciiva.com/2456/pyu-r-int-thick-7-2456973.pdf; ComponentLink5Description: https://datasheet.ciiva.com/2456/pyu-r-int-thick-7-2456973.pdf; ComponentLink6URL: https://datasheet.ciiva.com/2456/pyu-r-int-thick-7-2456974.pdf; ComponentLink6Description: https://datasheet.ciiva.com/2456/pyu-r-int-thick-7-2456974.pdf; ComponentLink7URL: https://datasheet.ciiva.com/16747/rc0805-16747087.pdf; ComponentLink7Description: https://datasheet.ciiva.com/16747/rc0805-16747087.pdf; Supplier Part Number 1: 311-10.0KCRCT-ND
R45 = RNCF0603BTE213K: RES SMD 213K OHM 0.1% 1/10W 0603; Manufacturer: Stackpole Electronics; Temperature Coefficient: 25ppm/°C; Supplier 1: Digi-Key; Manufacturer Part Number: RNCF0603BTE213K; Stock 1: 5000; Pricing 1: 1 = 0.42000, 10 = 0.29900, 100 = 0.11950, 1000 = 0.05891, 2500 = 0.05457 (USD); RoHS: Yes; Mount: Surface Mount; Case/Package: 0603; Contact Plating: Tin; Min Operating Temperature: -55°C; Max Operating Temperature: 155°C; Packaging: Tape and Reel; Tolerance: 0.1%; Composition: Thin Film; Radiation Hardening: No; ComponentLink1URL: https://www.seielect.com/catalog/SEI-Packaging.pdf?src-supplier=Digi-Key; ComponentLink1Description: https://www.seielect.com/catalog/SEI-Packaging.pdf?src-supplier=Digi-Key; ComponentLink2URL: https://www.seielect.com/Catalog/SEI-rncf.pdf?src-supplier=Avnet; ComponentLink2Description: https://www.seielect.com/Catalog/SEI-rncf.pdf?src-supplier=Avnet; Supplier Part Number 1: RNCF0603BTE213KCT-ND
R46 = RMCF0603FT68K1: RES SMD 68.1K OHM 1% 1/10W 0603; Manufacturer: Stackpole Electronics; Power Rating: 100mW; Temperature Coefficient: 100ppm/°C; Supplier 1: Digi-Key; Manufacturer Part Number: RMCF0603FT68K1; Stock 1: 40093; Pricing 1: 1 = 0.10000, 10 = 0.01700, 100 = 0.00680, 1000 = 0.00306, 2500 = 0.00266 (USD); RoHS: Yes; Mount: Surface Mount; Case/Package: 0603; Case Code (Metric): 1608; Case Code (Imperial): 0603; Contact Plating: Tin; Min Operating Temperature: -55°C; Max Operating Temperature: 155°C; Packaging: Tape and Reel; Tolerance: 1%; Composition: Thick Film; Number of Terminations: 2; Max Power Dissipation: 100mW; Features: Automotive AEC-Q200; Length: 0.061inch; Height: 0.022inch; Width: 0.031inch; Radiation Hardening: No; Lead Free: Lead Free; ComponentLink1URL: https://www.seielect.com/catalog/SEI-RMCF_RMCP.pdf?src-supplier=Avnet; ComponentLink1Description: https://www.seielect.com/catalog/SEI-RMCF_RMCP.pdf?src-supplier=Avnet; ComponentLink2URL: https://www.seielect.com/Catalog/SEI-RMCF_RMCP.pdf?src-supplier=Digi-Key; ComponentLink2Description: https://www.seielect.com/Catalog/SEI-RMCF_RMCP.pdf?src-supplier=Digi-Key; ComponentLink3URL: https://www.seielect.com/catalog/SEI-Packaging.pdf?src-supplier=Digi-Key; ComponentLink3Description: https://www.seielect.com/catalog/SEI-Packaging.pdf?src-supplier=Digi-Key; ComponentLink4URL: http://www.seielect.com/Catalog/SEI-RMC.pdf?src-supplier=Future+Electronics; ComponentLink4Description: http://www.seielect.com/Catalog/SEI-RMC.pdf?src-supplier=Future+Electronics; Supplier Part Number 1: RMCF0603FT68K1CT-ND
TB1 = Testpoint: GENERIC TESTPOINT
U9 = INA260AIPWR: IC MONITOR PWR/CURR 16TSSOP; Manufacturer: Texas Instruments; Accuracy: 0.02%; Output Current: 10mA; Supplier 1: Digi-Key; Manufacturer Part Number: INA260AIPWR; Stock 1: 4446; Pricing 1: 1=4.54, 10=4.077, 100=3.3401, 500=2.8434, 1000=2.39805 (USD); Mount: Surface Mount; Case/Package: TSSOP; Number of Pins: 16; Min Operating Temperature: -40°C; Max Operating Temperature: 125°C; Packaging: Tape and Reel; Supplier Part Number 1: 296-47777-1-ND
U10 = TPS2551QDBVRQ1: IC POWER-DIST SWITCH ADJ SOT23-6; Manufacturer: Texas Instruments; Min Supply Voltage: 2.5V; Max Supply Voltage: 6.5V; Max Power Dissipation: 625mW; Number of Outputs: 1; Output Current: 0pA; Interface: Serial; Max Input Voltage: 5.5V; Min Input Voltage: 4.5V; On-State Resistance: 85mR; Supplier 1: Digi-Key; Manufacturer Part Number: TPS2551QDBVRQ1; Stock 1: 5882; Pricing 1: 1 = 2.69000, 10 = 2.41700, 100 = 1.98040, 500 = 1.68586, 1000 = 1.42181 (USD); RoHS: Yes; Case/Package: SOT-23-6; Number of Pins: 6; Min Operating Temperature: -40°C; Max Operating Temperature: 125°C; Package Quantity: 3000; Packaging: Tape and Reel; Power Dissipation: 625mW; Radiation Hardening: No; REACH SVHC: No SVHC; Lead Free: Lead Free; ComponentLink1URL: https://datasheet.ciiva.com/1962/tps2551-q1-1962640.pdf?src-supplier=Digi-Key; ComponentLink1Description: https://datasheet.ciiva.com/1962/tps2551-q1-1962640.pdf?src-supplier=Digi-Key; ComponentLink2URL: https://datasheet.ciiva.com/4924/slvs850-120518-4924547.pdf?src-supplier=Mouser; ComponentLink2Description: https://datasheet.ciiva.com/4924/slvs850-120518-4924547.pdf?src-supplier=Mouser; ComponentLink3URL: https://datasheet.ciiva.com/3233/tps2551-q1-3233588.pdf?src-supplier=Avnet; ComponentLink3Description: https://datasheet.ciiva.com/3233/tps2551-q1-3233588.pdf?src-supplier=Avnet; ComponentLink4URL: https://datasheet.ciiva.com/15109/getdatasheetpartid-329852-15109046.pdf?src-supplier=Verical; ComponentLink4Description: https://datasheet.ciiva.com/15109/getdatasheetpartid-329852-15109046.pdf?src-supplier=Verical; ComponentLink5URL: https://datasheet.ciiva.com/15258/slvs850-15258699.pdf?src-supplier=Arrow+Europe; ComponentLink5Description: https://datasheet.ciiva.com/15258/slvs850-15258699.pdf?src-supplier=Arrow+Europe; ComponentLink6URL: https://datasheet.ciiva.com/1962/tps2551-q1-1962641.pdf?src-supplier=Digi-Key; ComponentLink6Description: https://datasheet.ciiva.com/1962/tps2551-q1-1962641.pdf?src-supplier=Digi-Key; ComponentLink7URL: https://datasheet.ciiva.com/1962/tps2551-q1-1962642.pdf?src-supplier=Digi-Key; ComponentLink7Description: https://datasheet.ciiva.com/1962/tps2551-q1-1962642.pdf?src-supplier=Digi-Key; Supplier Part Number 1: 296-23692-1-ND
U11 = TPS63070RNMT: IC REG BCK BST ADJ 2A 15VQFN; Manufacturer: Texas Instruments; Min Input Voltage: 2V; Max Input Voltage: 16V; Number of Outputs: 1; Min Output Voltage: 2.5V; Max Output Voltage: 9V; Switching Frequency: 2.4kHz; Quiescent Current: 50uA; Topology: Buck-Boost; Supplier 1: Digi-Key; Manufacturer Part Number: TPS63070RNMT; Stock 1: 18665; Pricing 1: 1 = 2.76000, 10 = 2.48100, 100 = 2.03260 (USD); RoHS: No; Number of Pins: 15; Max Operating Temperature: 125°C; Output Current: 2A; Packaging: Cut Tape; REACH SVHC: No SVHC; Lead Free: Lead Free; ComponentLink1URL: http://www.ti.com/lit/ds/symlink/tps63070.pdf?src-supplier=Digi-Key; ComponentLink1Description: http://www.ti.com/lit/ds/symlink/tps63070.pdf?src-supplier=Digi-Key; ComponentLink2URL: http://www.farnell.com/datasheets/2148335.pdf?src-supplier=Element14; ComponentLink2Description: http://www.farnell.com/datasheets/2148335.pdf?src-supplier=Element14; ComponentLink3URL: http://www.ti.com/lit/ds/symlink/tps63070.pdf?src-supplier=Farnell; ComponentLink3Description: http://www.ti.com/lit/ds/symlink/tps63070.pdf?src-supplier=Farnell; Supplier Part Number 1: 296-44764-1-ND